# Altium schematic sheet FPGA_7A35T_POWER.SchDoc: RFSoC AMC
size 420 x 297 mm; CmpIndex: 0; CompanyName: WUT; DrawnBy: T. Przywozki; Organization: WUT ISE; Address1: Warsaw University of Technology; Address2: Nowowiejska 15/19 00-665 Warsaw; Address3: Tomasz.Przywozki@pw.edu.pl; DocumentNumber: 17; Revision: 1; SheetNumber: 17; SheetTotal: 45; Project: RFSoC AMC; ModifiedBy: T. Przywozki; CreateDate: -; CheckedDate: -; DivGrp: ISE; Designer: T. Przywozki; ModifiedDate: -; ProjectName: ADC/DAC MEZZANINE
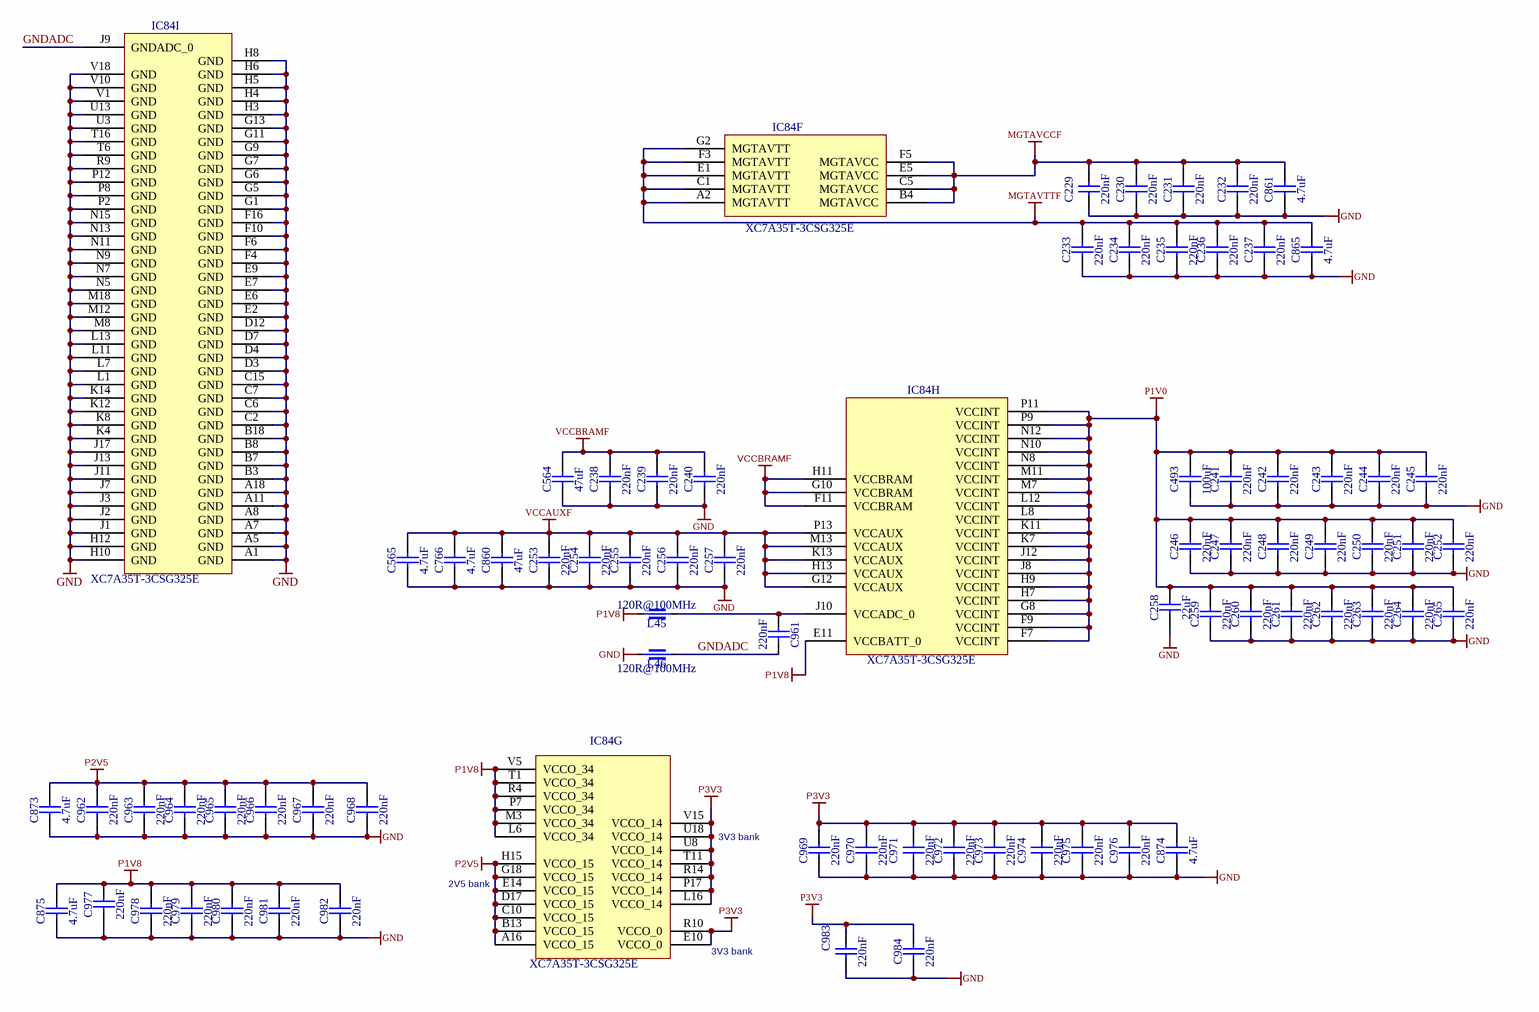
[diagram p0: FPGA_7A35T_POWER.SchDoc]

## Parts
C229  220nF  [CAPC0603X33N]
C230  220nF  [CAPC0603X33N]
C231  220nF  [CAPC0603X33N]
C232  220nF  [CAPC0603X33N]
C233  220nF  [CAPC0603X33N]
C234  220nF  [CAPC0603X33N]
C235  220nF  [CAPC0603X33N]
C236  220nF  [CAPC0603X33N]
C237  220nF  [CAPC0603X33N]
C238  220nF  [CAPC0603X33N]
C239  220nF  [CAPC0603X33N]
C240  220nF  [CAPC0603X33N]
C241  220nF  [CAPC0603X33N]
C242  220nF  [CAPC0603X33N]
C243  220nF  [CAPC0603X33N]
C244  220nF  [CAPC0603X33N]
C245  220nF  [CAPC0603X33N]
C246  220nF  [CAPC0603X33N]
C247  220nF  [CAPC0603X33N]
C248  220nF  [CAPC0603X33N]
C249  220nF  [CAPC0603X33N]
C250  220nF  [CAPC0603X33N]
C251  220nF  [CAPC0603X33N]
C252  220nF  [CAPC0603X33N]
C253  220nF  [CAPC0603X33N]
C254  220nF  [CAPC0603X33N]
C255  220nF  [CAPC0603X33N]
C256  220nF  [CAPC0603X33N]
C257  220nF  [CAPC0603X33N]
C258  22uF  [CAPC2012X135N]
C259  220nF  [CAPC0603X33N]
C260  220nF  [CAPC0603X33N]
C261  220nF  [CAPC0603X33N]
C262  220nF  [CAPC0603X33N]
C263  220nF  [CAPC0603X33N]
C264  220nF  [CAPC0603X33N]
C265  220nF  [CAPC0603X33N]
C493  100uF  [CAPC3225X270N]
C564  47uF  [CAPC1608X100N]
C565  4.7uF  [CAPC1005X55N]
C766  4.7uF  [CAPC1005X55N]
C860  47uF  [CAPC1608X100N]
C861  4.7uF  [CAPC1005X55N]
C865  4.7uF  [CAPC1005X55N]
C873  4.7uF  [CAPC1005X55N]
C874  4.7uF  [CAPC1005X55N]
C875  4.7uF  [CAPC1005X55N]
C961  220nF  [CAPC0603X33N]
C962  220nF  [CAPC0603X33N]
C963  220nF  [CAPC0603X33N]
C964  220nF  [CAPC0603X33N]
C965  220nF  [CAPC0603X33N]
C966  220nF  [CAPC0603X33N]
C967  220nF  [CAPC0603X33N]
C968  220nF  [CAPC0603X33N]
C969  220nF  [CAPC0603X33N]
C970  220nF  [CAPC0603X33N]
C971  220nF  [CAPC0603X33N]
C972  220nF  [CAPC0603X33N]
C973  220nF  [CAPC0603X33N]
C974  220nF  [CAPC0603X33N]
C975  220nF  [CAPC0603X33N]
C976  220nF  [CAPC0603X33N]
C977  220nF  [CAPC0603X33N]
C978  220nF  [CAPC0603X33N]
C979  220nF  [CAPC0603X33N]
C980  220nF  [CAPC0603X33N]
C981  220nF  [CAPC0603X33N]
C982  220nF  [CAPC0603X33N]
C983  220nF  [CAPC0603X33N]
C984  220nF  [CAPC0603X33N]
IC84  XC7A35T-3CSG325E  [CSG325]  (parts F,G,H,I of 9)
L45  120R@100MHz  [INDC1005X55N]
L46  120R@100MHz  [INDC1005X55N]

## Nets
GND: C229.1 C230.1 C231.1 C232.1 C233.1 C234.1 C235.1 C236.1 C237.1 C238.1 C239.1 C240.1 C241.1 C242.1 C243.1 C244.1 C245.1 C246.1 C247.1 C248.1 C249.1 C250.1 C251.1 C252.1 C253.1 C254.1 C255.1 C256.1 C257.1 C258.1 C259.1 C260.1 C261.1 C262.1 C263.1 C264.1 C265.1 C493.1 C564.1 C565.1 C766.1 C860.1 C861.1 C865.1 C873.1 C874.1 C875.1 C962.1 C963.1 C964.1 C965.1 C966.1 C967.1 C968.1 C969.1 C970.1 C971.1 C972.1 C973.1 C974.1 C975.1 C976.1 C977.1 C978.1 C979.1 C980.1 C981.1 C982.1 C983.1 C984.1 IC84.A1(GND) IC84.A5(GND) IC84.A7(GND) IC84.A8(GND) IC84.A11(GND) IC84.A18(GND) IC84.B3(GND) IC84.B7(GND) IC84.B8(GND) IC84.B18(GND) IC84.C2(GND) IC84.C6(GND) IC84.C7(GND) IC84.C15(GND) IC84.D3(GND) IC84.D4(GND) IC84.D7(GND) IC84.D12(GND) IC84.E2(GND) IC84.E6(GND) IC84.E7(GND) IC84.E9(GND) IC84.F4(GND) IC84.F6(GND) IC84.F10(GND) IC84.F16(GND) IC84.G1(GND) IC84.G5(GND) IC84.G6(GND) IC84.G7(GND) IC84.G9(GND) IC84.G11(GND) IC84.G13(GND) IC84.H3(GND) IC84.H4(GND) IC84.H5(GND) IC84.H6(GND) IC84.H8(GND) IC84.H10(GND) IC84.H12(GND) IC84.J1(GND) IC84.J2(GND) IC84.J3(GND) IC84.J7(GND) IC84.J11(GND) IC84.J13(GND) IC84.J17(GND) IC84.K4(GND) IC84.K8(GND) IC84.K12(GND) IC84.K14(GND) IC84.L1(GND) IC84.L7(GND) IC84.L11(GND) IC84.L13(GND) IC84.M8(GND) IC84.M12(GND) IC84.M18(GND) IC84.N5(GND) IC84.N7(GND) IC84.N9(GND) IC84.N11(GND) IC84.N13(GND) IC84.N15(GND) IC84.P2(GND) IC84.P8(GND) IC84.P12(GND) IC84.R9(GND) IC84.T6(GND) IC84.T16(GND) IC84.U3(GND) IC84.U13(GND) IC84.V1(GND) IC84.V10(GND) IC84.V18(GND) L46.1
MGTAVCCF: C229.2 C230.2 C231.2 C232.2 C861.2 IC84.B4(MGTAVCC) IC84.C5(MGTAVCC) IC84.E5(MGTAVCC) IC84.F5(MGTAVCC)
MGTAVTTF: C233.2 C234.2 C235.2 C236.2 C237.2 C865.2 IC84.A2(MGTAVTT) IC84.C1(MGTAVTT) IC84.E1(MGTAVTT) IC84.F3(MGTAVTT) IC84.G2(MGTAVTT)
P1V0: C241.2 C242.2 C243.2 C244.2 C245.2 C246.2 C247.2 C248.2 C249.2 C250.2 C251.2 C252.2 C258.2 C259.2 C260.2 C261.2 C262.2 C263.2 C264.2 C265.2 C493.2 IC84.F7(VCCINT) IC84.F9(VCCINT) IC84.G8(VCCINT) IC84.H7(VCCINT) IC84.H9(VCCINT) IC84.J8(VCCINT) IC84.J12(VCCINT) IC84.K7(VCCINT) IC84.K11(VCCINT) IC84.L8(VCCINT) IC84.L12(VCCINT) IC84.M7(VCCINT) IC84.M11(VCCINT) IC84.N8(VCCINT) IC84.N10(VCCINT) IC84.N12(VCCINT) IC84.P9(VCCINT) IC84.P11(VCCINT)
P1V8: C875.2 C977.2 C978.2 C979.2 C980.2 C981.2 C982.2 IC84.E11(VCCBATT_0) IC84.L6(VCCO_34) IC84.M3(VCCO_34) IC84.P7(VCCO_34) IC84.R4(VCCO_34) IC84.T1(VCCO_34) IC84.V5(VCCO_34) L45.1
P2V5: C873.2 C962.2 C963.2 C964.2 C965.2 C966.2 C967.2 C968.2 IC84.A16(VCCO_15) IC84.B13(VCCO_15) IC84.C10(VCCO_15) IC84.D17(VCCO_15) IC84.E14(VCCO_15) IC84.G18(VCCO_15) IC84.H15(VCCO_15)
P3V3: C874.2 C969.2 C970.2 C971.2 C972.2 C973.2 C974.2 C975.2 C976.2 C983.2 C984.2 IC84.E10(VCCO_0) IC84.L16(VCCO_14) IC84.P17(VCCO_14) IC84.R10(VCCO_0) IC84.R14(VCCO_14) IC84.T11(VCCO_14) IC84.U8(VCCO_14) IC84.U18(VCCO_14) IC84.V15(VCCO_14)
VCCAUXF: C253.2 C254.2 C255.2 C256.2 C257.2 C565.2 C766.2 C860.2 IC84.G12(VCCAUX) IC84.H13(VCCAUX) IC84.K13(VCCAUX) IC84.M13(VCCAUX) IC84.P13(VCCAUX)
VCCBRAMF: C238.2 C239.2 C240.2 C564.2 IC84.F11(VCCBRAM) IC84.G10(VCCBRAM) IC84.H11(VCCBRAM)
GNDADC: C961.2 IC84.J9(GNDADC_0) L46.2
NetC961_1: C961.1 IC84.J10(VCCADC_0) L45.2

## Notes on the sheet
- 3V3 bank
- (near IC84) 2V5 bank
- (near IC84) 3V3 bank
- Project/Equipment
- Document
- Designer
- Drawn by
- Check.by
- Copyright WUT ISE 2021
  This documentation describes Open Hardware and is licensed under CERN OHL v.1.1. You may redistribute and modify this documentaction under the terms of the CERN OHL v1.1.
  (http://ohwr.org/CERNOHL). This documentation is dristributed WITHOUT ANY EXPRESS OR IMPLIED WARRANTY, INCLUDING OF MERCHANTABLITY, SATISFACTORY QUALITY AND FITNESS FOR A PARTICULAR PURPOSE. Please see the CERN OHL v.1.1 for applicable conditions
- File
- Last Mod.
- Print Date
- Sheet
- Size
- A3
- of
- Rev
- Contact:

## Library data of the parts
C229-C257 C259-C265 C961-C984 = CC0201_220NF_6.3V_20%_X5R: Non-polarised capacitor; Manufacturer: GENERIC; Manufacturer1 Part Number: JMK063BJ224MP-F; Part Description: SMD Multilayer Chip Ceramic Capacitor; TC: X5R; Tolerance: ±20%; Voltage: 6.3V; Case: 0201; Manufacturer Part Number: CC0201_220NF_6.3V_20%_X5R; Manufacturer1 Example: TAIYO YUDEN; Part Number: CC0201_220NF_6.3V_20%_X5R; Pin Count: 2; SMD: Yes; Status: Not Recommended; Value: 220nF; Component Kind: Standard; Component Type: Standard; Mounted: Yes; Socket: No; Sense: No; Manufacturer1 ComponentHeight: 0.33mm; HelpURL: \\cern.ch\dfs\Applications\Altium\Datasheets\CC0201_X5R_TAIYO-YUDEN_STANDARD-CLASS2.pdf; Author: CERN DEM JLC; CreateDate: 27.05.2010; LatestRevisionDate: 27.05.2010
C258 = CC0805_22UF_6.3V_20%_X5R: Non-polarised capacitor; Manufacturer: GENERIC; Manufacturer1 Part Number: C0805C226M9PAC7800; Part Description: SMD Multilayer Chip Ceramic Capacitor; TC: X5R; Tolerance: ±20%; Voltage: 6.3V; Case: 0805; Manufacturer Part Number: CC0805_22UF_6.3V_20%_X5R; Manufacturer1 Example: KEMET; Part Number: CC0805_22UF_6.3V_20%_X5R; Pin Count: 2; SMD: Yes; Status: Preferred; Value: 22uF; Component Kind: Standard; Component Type: Standard; Mounted: Yes; Socket: No; Sense: No; Manufacturer1 ComponentHeight: 1.45mm; HelpURL: \\cern.ch\dfs\Applications\Altium\Datasheets\CC1206_X5R_KEMET.pdf; Author: CERN DEM JLC; CreateDate: 03.12.2007; LatestRevisionDate: 03.12.2007
C493 = CC1210_100UF_6.3V_20%_X5R: Non-polarised capacitor; Part Description: SMD Multilayer Chip Ceramic Capacitor; Manufacturer: GENERIC; Manufacturer1 Part Number: GRM32ER60J107ME20L; Voltage: 6.3V; Tolerance: ±20%; TC: X5R; Part Number: CC1210_100UF_6.3V_20%_X5R; Component Kind: Standard; Component Type: Standard; Pin Count: 2; Value: 100uF; Status: Preferred; Manufacturer Part Number: CC1210_100UF_6.3V_20%_X5R; Case: 1210; Mounted: Yes; Socket: No; SMD: Yes; Sense: No; Manufacturer1 Example: MURATA; Manufacturer1 ComponentHeight: 2.7mm; HelpURL: \\cern.ch\dfs\Applications\Altium\Datasheets\CC1210_X5R_MURATA.pdf; Author: CERN DEM JLC; CreateDate: 19.04.2010; LatestRevisionDate: 19.04.2010
C564 C860 = CC0603_47UF_6.3V_20%_X5R: Non-polarised capacitor; Part Description: SMD Multilayer Chip Ceramic Capacitor; Manufacturer: GENERIC; Manufacturer1 Part Number: GRM188R60J476ME15D; Voltage: 6.3V; Tolerance: ±20%; TC: X5R; Part Number: CC0603_47UF_6.3V_20%_X5R; Component Kind: Standard; Component Type: Standard; Pin Count: 2; Value: 47uF; Status: None; Manufacturer Part Number: CC0603_47UF_6.3V_20%_X5R; Case: 0603; Mounted: Yes; Socket: No; SMD: Yes; Sense: No; Manufacturer1 Example: MURATA; Manufacturer1 ComponentHeight: 1mm; HelpURL: \\cern.ch\dfs\Applications\Altium\Datasheets\CC0603_MURATA_GRM188R60J476ME15D.pdf; Author: CERN DEM JLC; CreateDate: 01.02.2018; LatestRevisionDate: 01.02.2018
C565 C766 C861 C865 C873-C875 = CC0402_4.7UF_6.3V_20%_X5R: Non-polarised capacitor; Part Description: SMD Multilayer Chip Ceramic Capacitor; Manufacturer: GENERIC; Manufacturer1 Part Number: C1005X5R0J475M050BC; Voltage: 6.3V; Tolerance: ±20%; TC: X5R; Part Number: CC0402_4.7UF_6.3V_20%_X5R; Component Kind: Standard; Component Type: Standard; Pin Count: 2; Value: 4.7uF; Status: Preferred; Manufacturer Part Number: CC0402_4.7UF_6.3V_20%_X5R; Case: 0402; Mounted: Yes; Socket: No; SMD: Yes; Sense: No; Manufacturer1 Example: TDK; Manufacturer1 ComponentHeight: 0.65mm; HelpURL: \\cern.ch\dfs\Applications\Altium\Datasheets\CC0402_X5R_TDK_C.pdf; Author: CERN DEM JLC; CreateDate: 03.03.2015; LatestRevisionDate: 03.03.2015
IC84 = CMP-0383-00015-1: Artix-7 FPGA, 150 User I/Os, 4 GTP, 324-Ball BGA, Speed Grade 3, Extended Grade, Pb-Free; Manufacturer: Xilinx; CMTs: 5; Available User I/O: 150; GTP: 4; Speed Grades: 3; Total Block RAM: 1800 Kb; Logic Cells: 33280; ComponentLink3URL: http://www.xilinx.com/support/documentation/user_guides/ug475_7Series_Pkg_Pinout.pdf; ComponentLink3Description: Pinout; Operating Temperature Range: Extended; PackageReference: CSG-325; PackageDescription: 324-Ball Wire-Bond Chip-Scale BGA, Body 15 x 15 mm, Pitch 0.8 mm; ComponentLink4URL: http://www.xilinx.com/support/documentation/user_guides/ug475_7Series_Pkg_Pinout.pdf; ComponentLink1Description: Manufacturer URL; ComponentLink2Description: Datasheet; DatasheetVersion: Rev. 1.15; PartNumber: XC7A35T-3CSG325E; Mounting Technology: Surface Mount; ComponentLink1URL: http://www.xilinx.com/; PackageVersion: Rev. 1.11; ComponentLink2URL: http://www.xilinx.com/support/documentation/data_sheets/ds180_7Series_Overview.pdf; Maximum Distributed RAM: 400 Kb; ComponentLink4Description: Package Specification
L45 L46 = IND0402_MURATA_BLM15PX121SN1D: Manufacturer: MURATA; Part Description: SMD EMIFIL Chip Ferrite Bead; Power: 2A; Resistance: 0.055R; Tolerance: ±25%; Case: 0402; ComponentHeight: 0.55mm; Manufacturer Part Number: BLM15PX121SN1D; Part Number: IND0402_MURATA_BLM15PX121SN1D; Pin Count: 2; SMD: Yes; Value: 120R@100MHz; Component Kind: Standard; Component Type: Standard; Status: None; Mounted: Yes; Socket: No; Sense: No; HelpURL: \\cern.ch\dfs\Applications\Altium\Datasheets\IND0402_MURATA_BLM15PX.pdf; Author: CERN DEM JMW; CreateDate: 19.02.2014; LatestRevisionDate: 25.10.2018